# EAGLE design BD_LLC_USB_Interlock_Flipped (EAGLE 7.3.0)
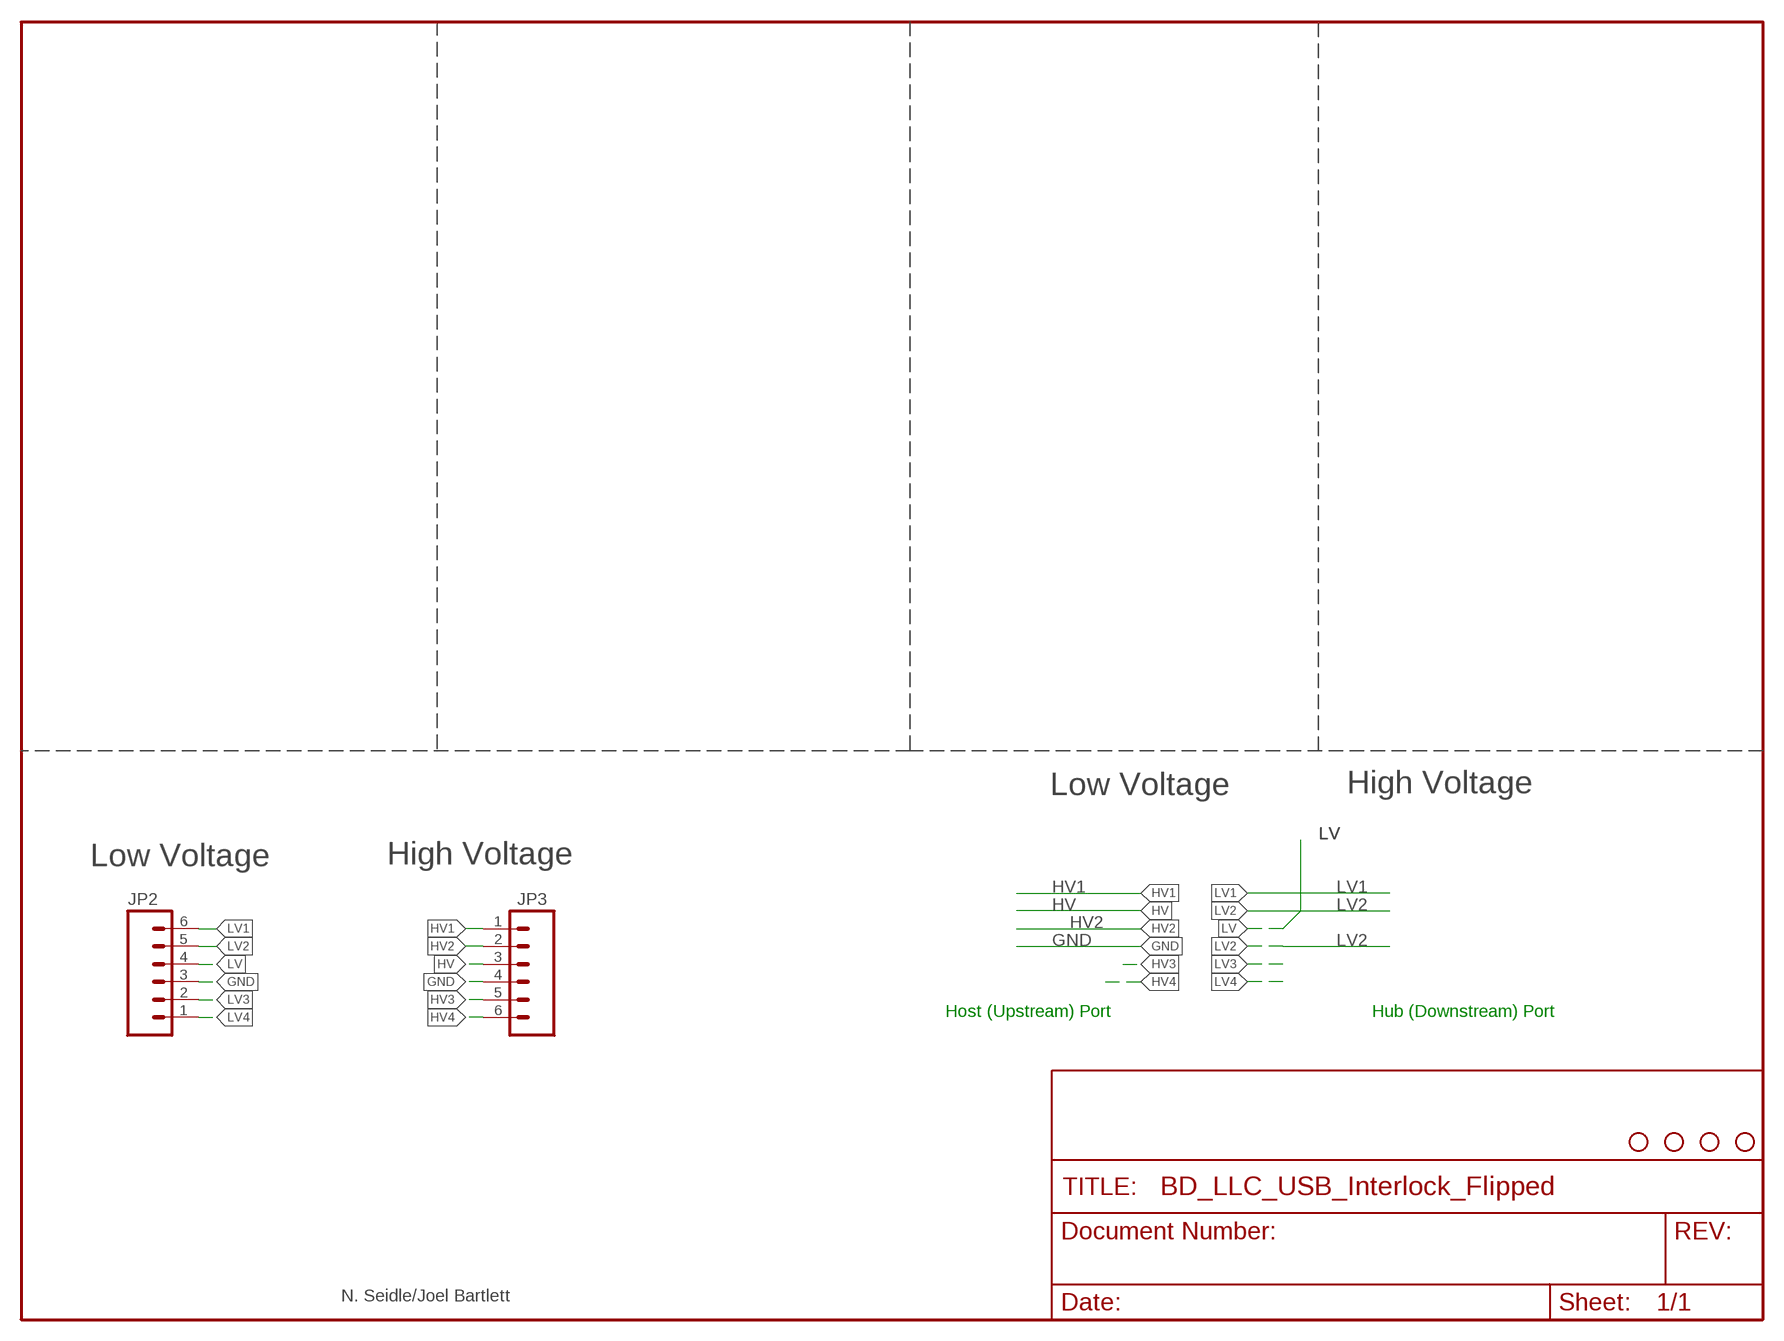
[diagram p0: schematic, sheet 1]

## Parts
JP2  M06SIP  [1X06]
JP3  M06SIP  [1X06]
U$3  STAND-OFF  [STAND-OFF]
U$4  STAND-OFF  [STAND-OFF]
U$5  STAND-OFF  [STAND-OFF]
U$7  STAND-OFF  [STAND-OFF]

## Nets
GND: JP2.3 JP3.4
HV: JP3.3
HV1: JP3.1
HV2: JP3.2
HV3: JP3.5
HV4: JP3.6
LV: JP2.4
LV1: JP2.6
LV2: JP2.5
LV3: JP2.2
LV4: JP2.1

## Notes on the sheet
- Low Voltage | High Voltage
- Low Voltage | High Voltage
- Host (Upstream) Port | Hub (Downstream) Port
- N. Seidle/Joel Bartlett

## Library data of the parts
JP2 JP3 = SparkFun:M06: Header 6 Standard 6-pin 0.1" header. Use with straight break away headers (SKU : PRT-00116), right angle break away headers (PRT-00553), swiss pins (PRT-00743), machine pins (PRT-00117), and female headers (PRT-00115). Molex polarized connector foot print use with SKU : PRT-08094 with associated crimp pins and housings. NOTES ON THE VARIANTS LOCK and LOCK_LONGPADS... This footprint was designed to help hold the alignment of a through-hole component (i.e. 6-pin header) while soldering it into place. You may notice that each hole has been shifted either up or down by 0.005 of an inch from it's more standard position (which is a perfectly straight line). This slight alteration caused the pins (the squares in the middle) to touch the edges of the holes. Because they are alternating, it causes a "brace" to hold the component in place. 0.005 has proven to be the perfect amount of "off-center" position when using our standard breakaway headers. Although looks a little odd when you look at the bare footprint, once you have a header in there, the alteration is very hard to notice. Also, if you push a header all the way into place, it is covered up entirely on the bottom side. This idea of altering the position of holes to aid alignment will be further integrated into the Sparkfun Library for other footprints. It can help hold any component with 3 or more connection pins.
U$3-U$5 U$7 = SparkFun:STAND-OFF: Stand Off This is the mechanical footprint for a #4 phillips button head screw. Use the keepout ring to avoid running the screw head into surrounding components. SKU : PRT-00447

## Board
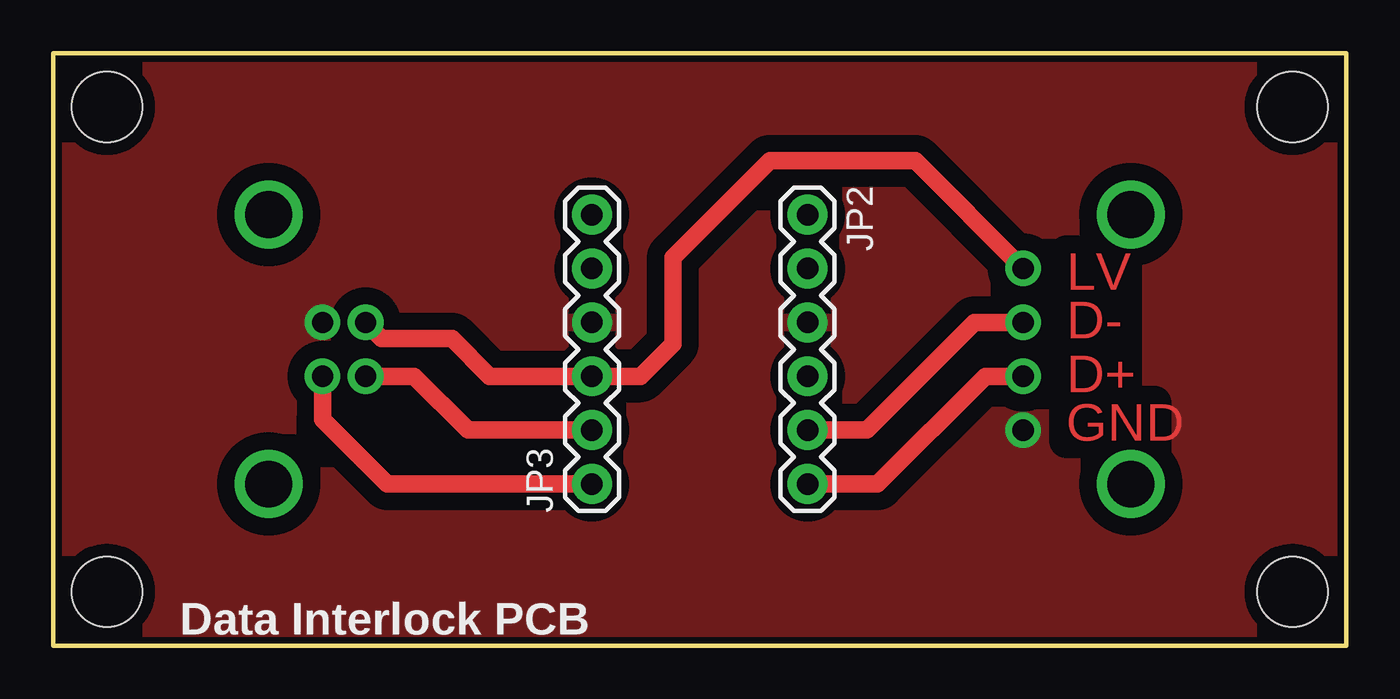
[diagram p1: board, top side]

Size 60.96 x 27.94 mm. Coordinates in mm from the lower left corner, seen from the top.
Outline: 0,0 60.96,0 60.96,27.94 0,27.94 0,0
Copper layers (1*16): Top 0.035mm / dielectric 1.5mm / Bottom 0.035mm
Design rules "SparkFun *": minimum track width 8mil, minimum drill 20mil, track to track 32mil, track to pad 32mil, pad to pad 16mil, via to via 16mil, smd to smd 16mil, copper to edge 8mil, drill to drill 8mil, minimum pad ring 12mil, minimum via ring 10mil, stop-mask expansion 4mil, vias tented up to drill 20mil, thermal gap 10mil

### Footprints (pad centres in the part's own frame; a part is rotated, then mirrored left to right if it is on the bottom)
1X06 = drill 1.016 pad 1.88: 1 0,0; 2 2.54,0; 3 5.08,0; 4 7.62,0; 5 10.16,0; 6 12.7,0
STAND-OFF = hole 3.302: 0,0

### Placement (x,y rotation side)
JP2  35.56,20.32 270 top
JP3  25.4,7.62 90 top
U$3  2.54,2.54 0 top
U$4  58.42,2.54 0 top
U$5  58.42,25.4 0 top
U$7  2.54,25.4 0 top

### Tracks (layer width: path | path; a pad name or v marks a point on that pad's centre or on a via)
GND  (via drill 1 pad 1.68)
  other vias: 12.7,15.24 45.72,10.16
  pour Top (isolate 0.305): 0,27.94 60.96,27.94 60.96,0 0,0
HV  (via drill 1 pad 1.68)
  Top 0.813: v14.73,15.24 15.49,14.48 18.8,14.48 20.57,12.7 JP3.3 27.69,12.7 29.21,14.22 29.21,18.29 33.78,22.86 40.64,22.86 v45.72,17.78
HV1  (via drill 1 pad 1.68)
  Top 0.813: v12.7,12.7 12.7,10.67 15.75,7.62 JP3.1
HV2  (via drill 1 pad 1.68)
  Top 0.813: v14.73,12.7 17.02,12.7 19.56,10.16 JP3.2
LV1  (via drill 1 pad 1.68)
  Top 0.813: JP2.6 38.86,7.62 43.94,12.7 v45.72,12.7
LV2  (via drill 1 pad 1.68)
  Top 0.813: v45.72,15.24 43.43,15.24 38.35,10.16 JP2.5
N$1  (via drill 2.2)
  other vias: 10.16,20.32
N$2  (via drill 2.2)
  other vias: 10.16,7.62
N$7  (via drill 2.2)
  other vias: 50.8,20.32
N$8  (via drill 2.2)
  other vias: 50.8,7.62

### Text on the board
Top: LV | D- | D+ | GND
tPlace: Data Interlock PCB